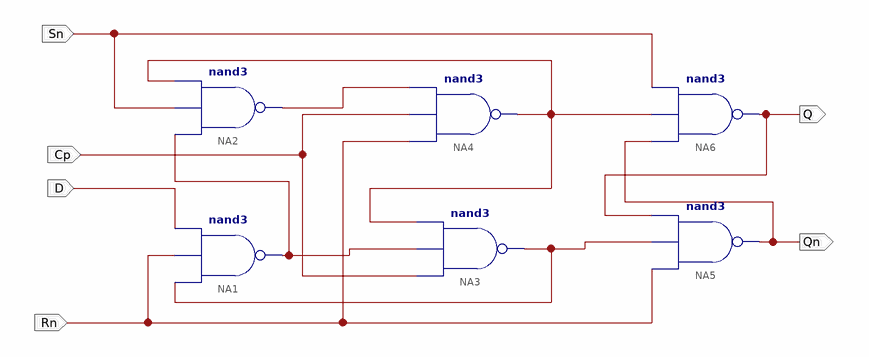
[diagram p0: schematic sheet 1]
// Xilinx ISE schematic MB_DFF.sch (spartan3) as structural Verilog: 6 symbols, 6 ports
module MB_DFF (
  input  Sn,
  input  Cp,
  input  D,
  input  Rn,
  output Q,
  output Qn
);

  wire XLXN_18, XLXN_20, XLXN_22, XLXN_24;

  nand NA6 (Q, Qn, XLXN_22, Sn);
  nand NA5 (Qn, Rn, XLXN_18, Q);
  nand NA4 (XLXN_22, Rn, Cp, XLXN_20);
  nand NA3 (XLXN_18, Cp, XLXN_24, XLXN_22);
  nand NA2 (XLXN_20, XLXN_24, Sn, XLXN_22);
  nand NA1 (XLXN_24, XLXN_18, Rn, D);
endmodule
